# EAGLE design MTCDisplay (EAGLE 7.6.0)

## Sheet 1 of 3
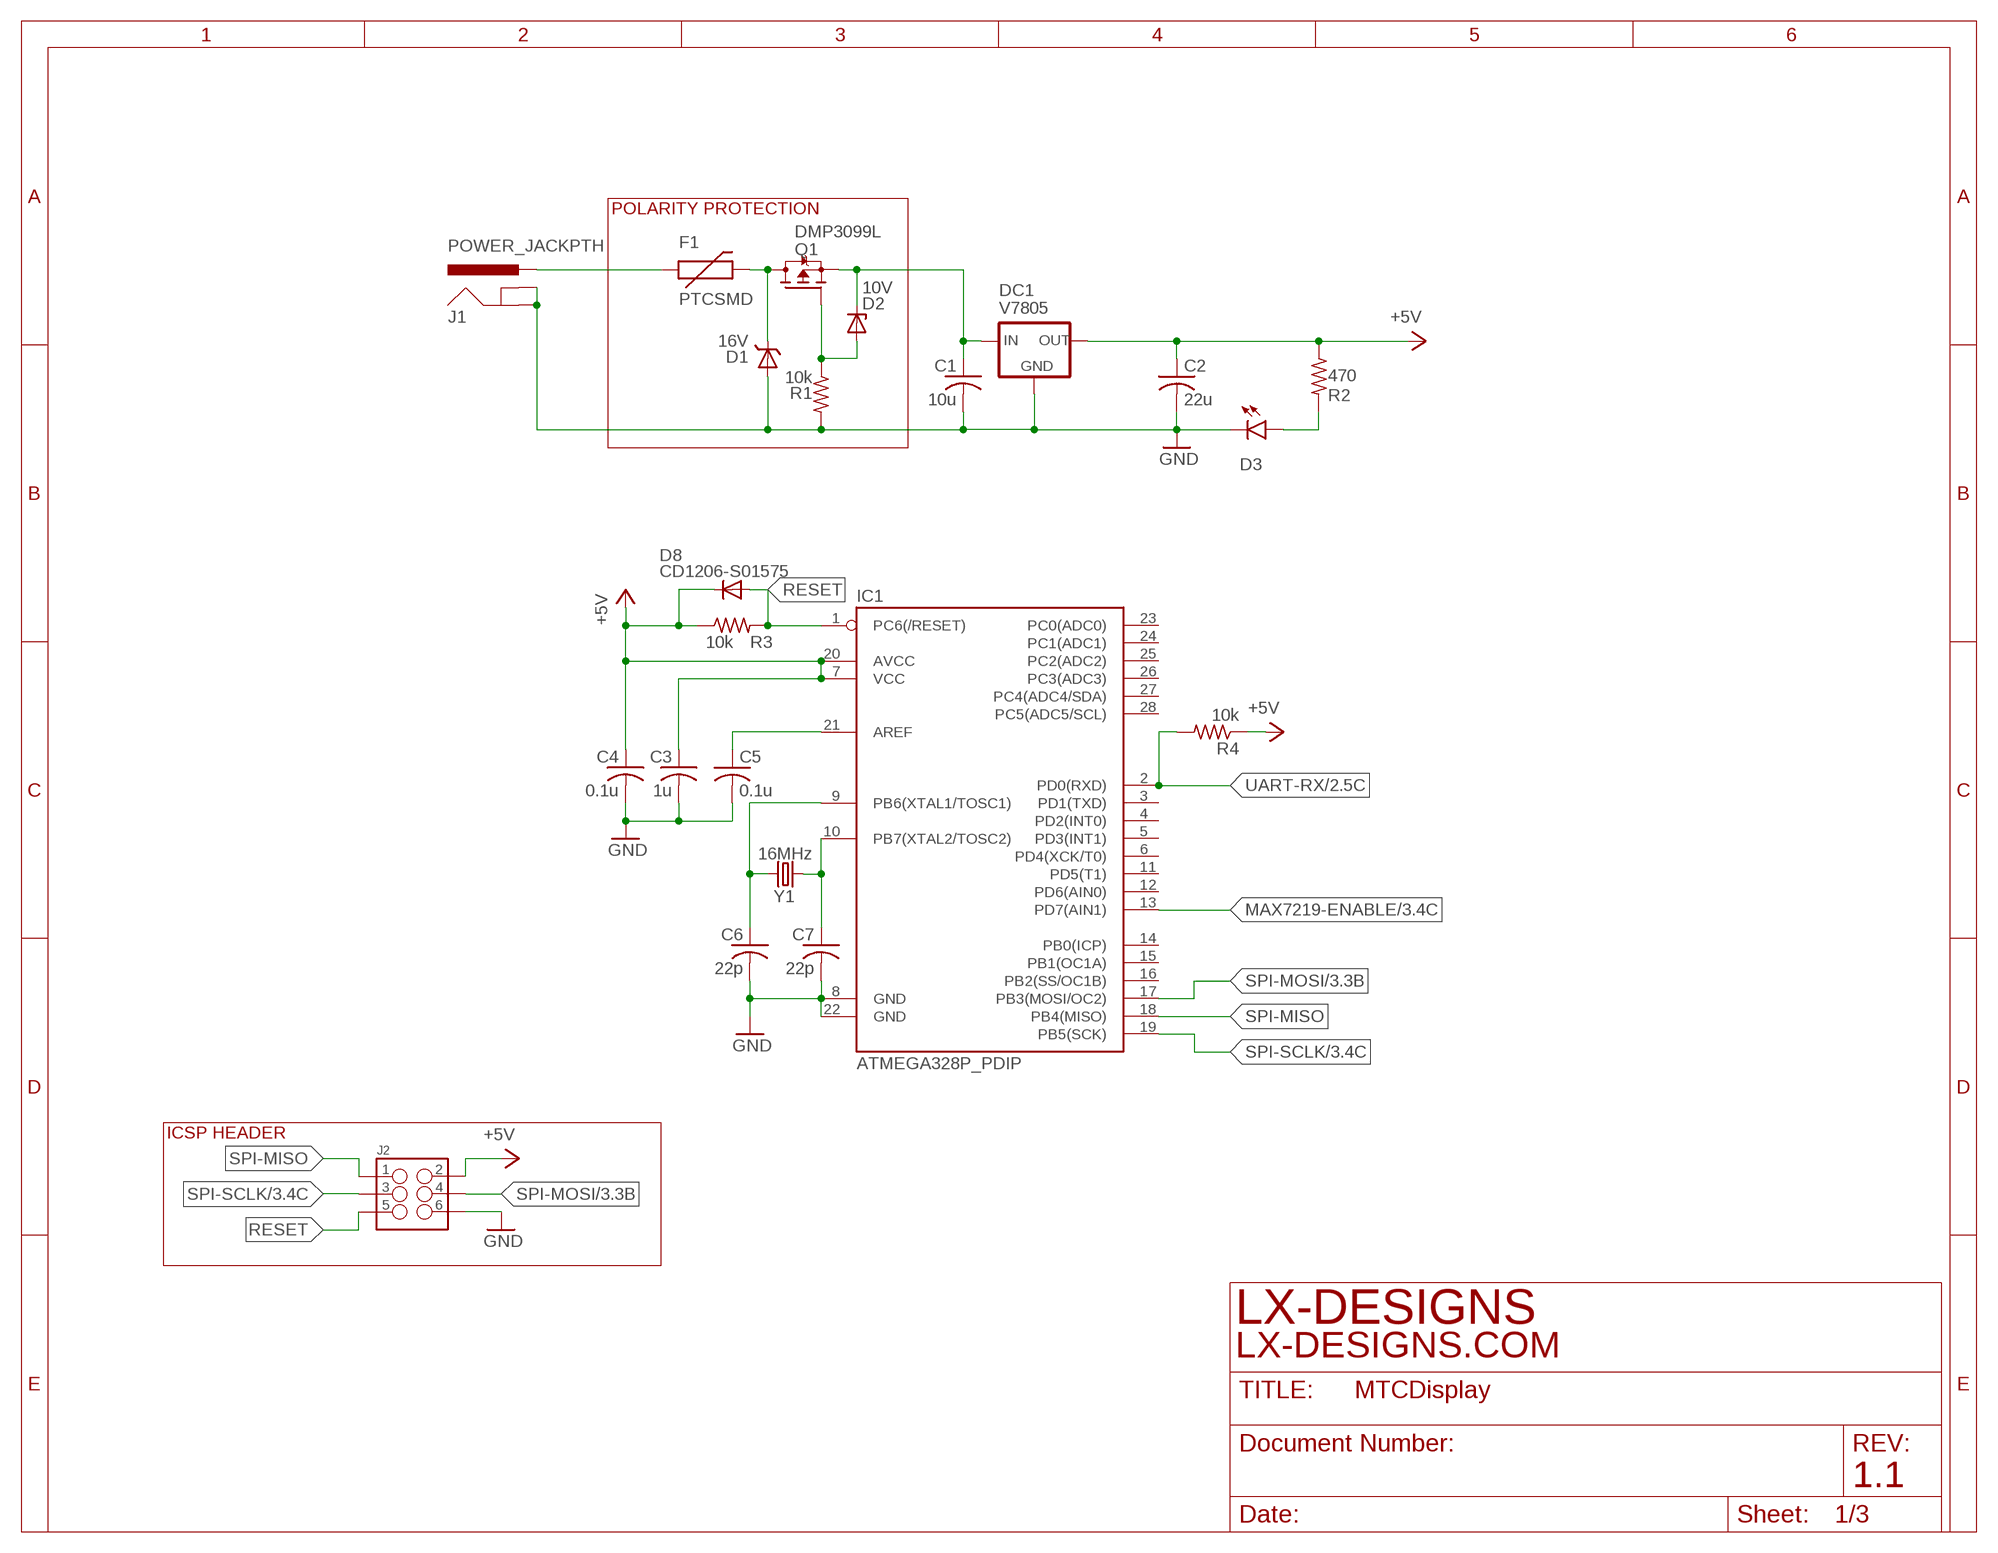
[diagram p0: schematic, sheet 1]

### Parts
C1  10u  C-USC0805K  [C0805K]
C2  22u  C-USC0805K  [C0805K]
C3  1u  C-USC0805K  [C0805K]
C4  0.1u  C-USC0805K  [C0805K]
C5  0.1u  C-USC0805K  [C0805K]
C6  22p  C-USC0805K  [C0805K]
C7  22p  C-USC0805K  [C0805K]
D1  16V  TVS-DIODESOD323-NOSILK  [SOD323-NOSILK]
D2  10V  ZENER-DIODESOD-323  [SOD323]
D3  LED0603  [LED-0603]
D8  CD1206-S01575  DIODE-MINIMELF  [MINIMELF]
DC1  V7805  [V7805]
F1  PTCSMD  [PTC-1206]
IC1  ATMEGA328P_PDIP  [DIL28-3]
J1  POWER_JACKPTH  [POWER_JACK_PTH]
J2  M03X2NO_SILK  [2X3-NS]
Q1  DMP3099L  BSA223SPSOT23  [SOT23]
R1  10k  R-US_R0805  [R0805]
R2  470  R-US_R0805  [R0805]
R3  10k  R-US_R0805  [R0805]
R4  10k  R-US_R0805  [R0805]
Y1  16MHz  CRYSTALHC49US  [HC49US]

### Nets
5V: C1.1 D2.C DC1.IN Q1.2(S)
+5V: C2.1 C3.1 C4.1 D8.C DC1.OUT IC1.7(VCC) IC1.20(AVCC) J2.2 R2.1 R3.1 R4.1 ; also sheet 2,3
GND: C1.2 C2.2 C3.2 C4.2 C5.2 C6.2 C7.2 D1.A D3.C DC1.GND IC1.8(GND) IC1.22(GND) J1.GND J1.GNDBREAK J2.6 R1.2 ; also sheet 2,3
MAX7219-ENABLE: IC1.13(PD7(AIN1)) ; also sheet 3
N$5: C6.1 IC1.9(PB6(XTAL1/TOSC1)) Y1.2
N$12: C5.1 IC1.21(AREF)
N$13: D3.A R2.2
N$15: C7.1 IC1.10(PB7(XTAL2/TOSC2)) Y1.1
N$16: F1.1 J1.PWR
N$17: D1.C F1.2 Q1.3(D)
N$19: D2.A Q1.1(G) R1.1
RESET: D8.A IC1.1(PC6(/RESET)) J2.5 R3.2
SPI-MISO: IC1.18(PB4(MISO)) J2.1
SPI-MOSI: IC1.17(PB3(MOSI/OC2)) J2.4 ; also sheet 3
SPI-SCLK: IC1.19(PB5(SCK)) J2.3 ; also sheet 3
UART-RX: IC1.2(PD0(RXD)) R4.2 ; also sheet 2
Unconnected: IC1.3(PD1(TXD)) IC1.4(PD2(INT0)) IC1.5(PD3(INT1)) IC1.6(PD4(XCK/T0)) IC1.11(PD5(T1)) IC1.12(PD6(AIN0)) IC1.14(PB0(ICP)) IC1.15(PB1(OC1A)) IC1.16(PB2(SS/OC1B)) IC1.23(PC0(ADC0)) IC1.24(PC1(ADC1)) IC1.25(PC2(ADC2)) IC1.26(PC3(ADC3)) IC1.27(PC4(ADC4/SDA)) IC1.28(PC5(ADC5/SCL))

### Notes on the sheet
- POLARITY PROTECTION
- ICSP HEADER
- LX-DESIGNS
- LX-DESIGNS.COM
- 1.1

## Sheet 2 of 3
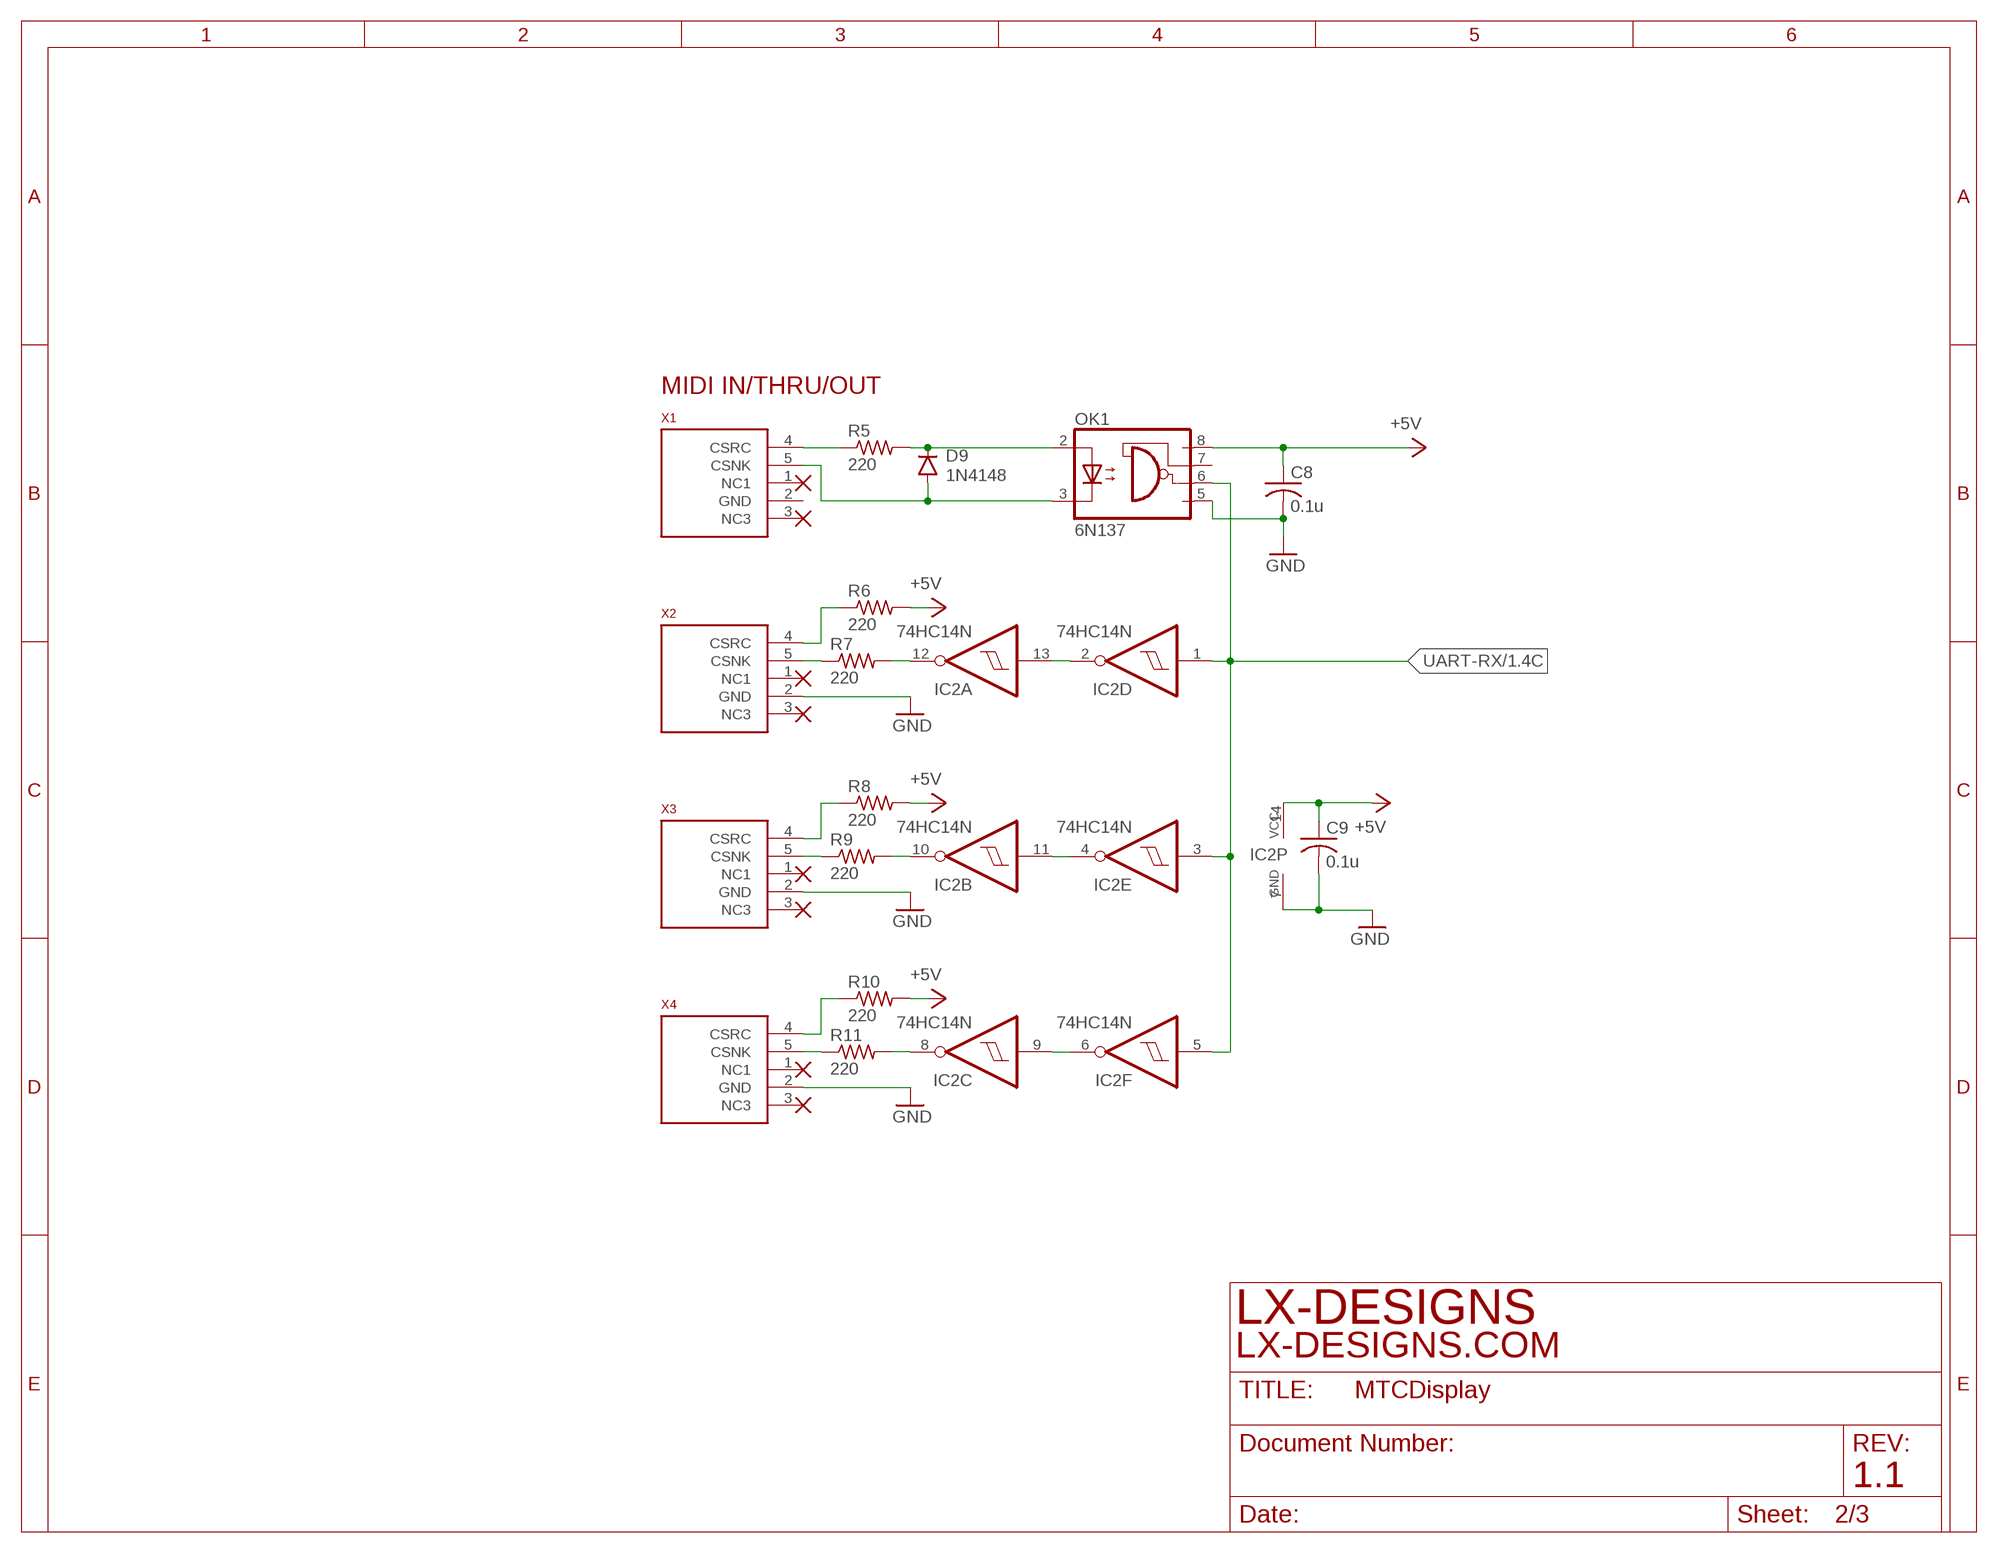
[diagram p1: schematic, sheet 2]

### Parts
C8  0.1u  C-USC0805K  [C0805K]
C9  0.1u  C-USC0805K  [C0805K]
D9  1N4148  DIODE1N4148  [DIODE-1N4148]
IC2  74HC14N  [DIL14]
OK1  6N137  [DIL08]
R5  220  R-US_R0805  [R0805]
R6  220  R-US_R0805  [R0805]
R7  220  R-US_R0805  [R0805]
R8  220  R-US_R0805  [R0805]
R9  220  R-US_R0805  [R0805]
R10  220  R-US_R0805  [R0805]
R11  220  R-US_R0805  [R0805]
X1  57PC5FSWITCHCRAFT  [DIN_5_FEMALE_SUPPORT]
X2  57PC5FSWITCHCRAFT  [DIN_5_FEMALE_SUPPORT]
X3  57PC5FSWITCHCRAFT  [DIN_5_FEMALE_SUPPORT]
X4  57PC5FSWITCHCRAFT  [DIN_5_FEMALE_SUPPORT]

### Nets
+5V: C8.1 C9.1 IC2.14(P:VCC) OK1.8(VCC) R6.2 R8.2 R10.2 ; also sheet 1,3
GND: C8.2 C9.2 IC2.7(P:GND) OK1.5(GND) X2.2(GND) X3.2(GND) X4.2(GND) ; also sheet 1,3
N$1: R5.1 X1.4(CSRC)
N$2: D9.C OK1.2(A) R5.2
N$3: D9.A OK1.3(C) X1.5(CSNK)
N$6: IC2.2(D:O) IC2.13(A:I)
N$7: IC2.12(A:O) R7.2
N$9: IC2.10(B:O) R9.2
N$10: R7.1 X2.5(CSNK)
N$11: R6.1 X2.4(CSRC)
N$18: IC2.8(C:O) R11.2
N$26: R9.1 X3.5(CSNK)
N$27: R8.1 X3.4(CSRC)
N$28: IC2.4(E:O) IC2.11(B:I)
N$29: IC2.6(F:O) IC2.9(C:I)
N$31: R11.1 X4.5(CSNK)
N$32: R10.1 X4.4(CSRC)
UART-RX: IC2.1(D:I) IC2.3(E:I) IC2.5(F:I) OK1.6(VO) ; also sheet 1
Unconnected: OK1.7(VE) X1.1(NC1) X1.2(GND) X1.3(NC3) X2.1(NC1) X2.3(NC3) X3.1(NC1) X3.3(NC3) X4.1(NC1) X4.3(NC3)

### Notes on the sheet
- MIDI IN/THRU/OUT
- LX-DESIGNS
- LX-DESIGNS.COM
- 1.1

## Sheet 3 of 3
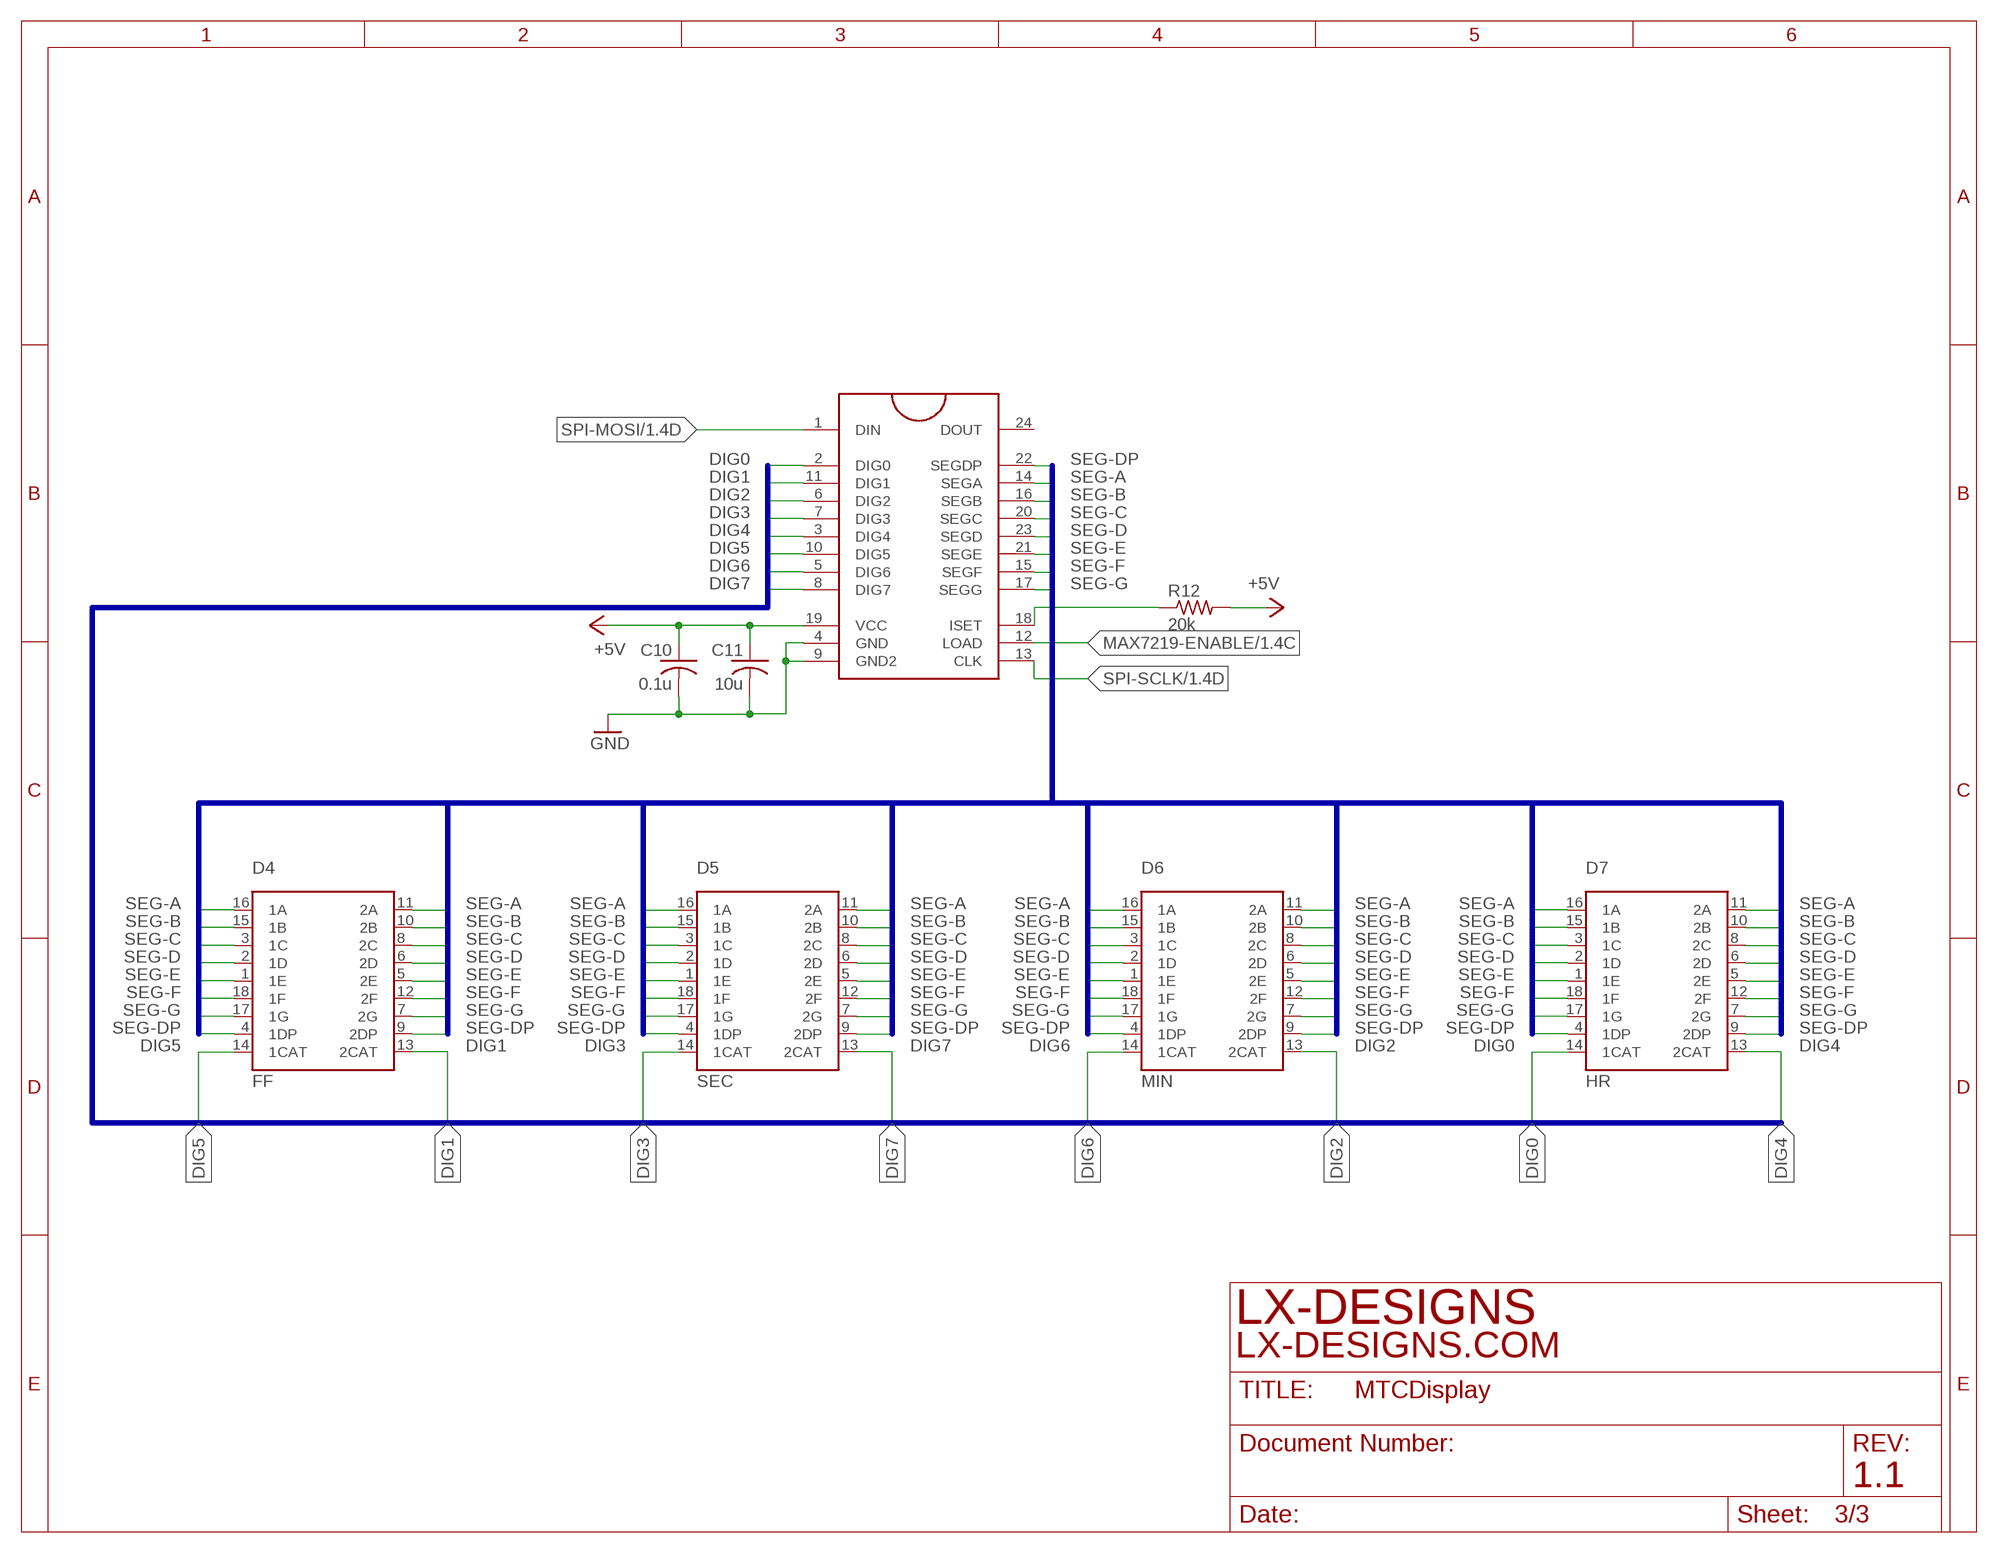
[diagram p2: schematic, sheet 3]

### Parts
C10  0.1u  C-USC0805K  [C0805K]
C11  10u  C-USC0805K  [C0805K]
D4  FF  299-XX-618-10-002000  [299-XX-43-618-10-002000]
D5  SEC  299-XX-618-10-002000  [299-XX-43-618-10-002000]
D6  MIN  299-XX-618-10-002000  [299-XX-43-618-10-002000]
D7  HR  299-XX-618-10-002000  [299-XX-43-618-10-002000]
IC3  MAX7219DIP  [DIL24]
R12  20k  R-US_R0805  [R0805]

### Nets
+5V: C10.1 C11.1 IC3.19(VCC) R12.2 ; also sheet 1,2
DIG0: D7.14(1CAT) IC3.2(DIG0)
DIG1: D4.13(2CAT) IC3.11(DIG1)
DIG2: D6.13(2CAT) IC3.6(DIG2)
DIG3: D5.14(1CAT) IC3.7(DIG3)
DIG4: D7.13(2CAT) IC3.3(DIG4)
DIG5: D4.14(1CAT) IC3.10(DIG5)
DIG6: D6.14(1CAT) IC3.5(DIG6)
DIG7: D5.13(2CAT) IC3.8(DIG7)
GND: C10.2 C11.2 IC3.4(GND) IC3.9(GND2) ; also sheet 1,2
MAX7219-ENABLE: IC3.12(LOAD) ; also sheet 1
N$4: IC3.18(ISET) R12.1
SEG-A: D4.11(2A) D4.16(1A) D5.11(2A) D5.16(1A) D6.11(2A) D6.16(1A) D7.11(2A) D7.16(1A) IC3.14(SEGA)
SEG-B: D4.10(2B) D4.15(1B) D5.10(2B) D5.15(1B) D6.10(2B) D6.15(1B) D7.10(2B) D7.15(1B) IC3.16(SEGB)
SEG-C: D4.3(1C) D4.8(2C) D5.3(1C) D5.8(2C) D6.3(1C) D6.8(2C) D7.3(1C) D7.8(2C) IC3.20(SEGC)
SEG-D: D4.2(1D) D4.6(2D) D5.2(1D) D5.6(2D) D6.2(1D) D6.6(2D) D7.2(1D) D7.6(2D) IC3.23(SEGD)
SEG-DP: D4.4(1DP) D4.9(2DP) D5.4(1DP) D5.9(2DP) D6.4(1DP) D6.9(2DP) D7.4(1DP) D7.9(2DP) IC3.22(SEGDP)
SEG-E: D4.1(1E) D4.5(2E) D5.1(1E) D5.5(2E) D6.1(1E) D6.5(2E) D7.1(1E) D7.5(2E) IC3.21(SEGE)
SEG-F: D4.12(2F) D4.18(1F) D5.12(2F) D5.18(1F) D6.12(2F) D6.18(1F) D7.12(2F) D7.18(1F) IC3.15(SEGF)
SEG-G: D4.7(2G) D4.17(1G) D5.7(2G) D5.17(1G) D6.7(2G) D6.17(1G) D7.7(2G) D7.17(1G) IC3.17(SEGG)
SPI-MOSI: IC3.1(DIN) ; also sheet 1
SPI-SCLK: IC3.13(CLK) ; also sheet 1
Unconnected: IC3.24(DOUT)

### Buses
SEG-A,SEG-B,SEG-C,SEG-D,SEG-E,SEG-F,SEG-G,SEG-DP
DIG0,DIG1,DIG2,DIG3,DIG4,DIG5,DIG6,DIG7

### Notes on the sheet
- LX-DESIGNS
- LX-DESIGNS.COM
- 1.1

## Library data of the parts
C1-C11 = rcl:C-US: CAPACITOR, American symbol
D1 = diode:TVS-DIODE
D2 = diode:ZENER-DIODE: Z-Diode
D3 = SparkFun-LED:LED: LEDs Standard schematic elements and footprints for 5mm, 3mm, 1206, and 0603 sized LEDs. 5mm - Spark Fun Electronics SKU : COM-00529 (and others)
D4-D7 = con-millmax:299-XX-618-10-002000: HDSP-5523 in Mill-Max 299-xx-618-10-002000 Socket
D8 = diode:DIODE-: DIODE
D9 = SparkFun-DiscreteSemi:DIODE: Diode These are standard reverse protection diodes and small signal diodes. SMA package can handle up to about 1A. SOD-323 can handle about 200mA. What the SOD-323 package when ordering, there are some mfgs out there that are 5-pin packages.; PROD_ID: DIO-08378
DC1 = v-reg:V7805
F1 = SparkFun-PowerIC:PTC: Resettable Fuse PTC Resettable Fuse. Spark Fun Electronics SKU : COM-08357; PROD_ID: RES-11150
IC1 = SparkFun-DigitalIC:ATMEGA328P_PDIP: uC used in the Arduino 32kb flash, 1k EEPROM, 2k SRAM This is the through-hole version of this chip.
IC2 = 74xx-eu:74*14: Hex schmitt trigger INVERTER
IC3 = SparkFun-DigitalIC:MAX7219: 8-digit, 8-segment LED display driver, serial input
J1 = SparkFun-Connectors:POWER_JACK: Power Jack This is the standard 5.5mm barrel jack for power. The PTH is the most common, proven, reliable, footprint. The Slot footprint only works if the mill layer is transmitted to the PCB fab house so be warned. Mating wall wart : TOL-00298 (and others); PROD_ID: CONN-08197
J2 = SparkFun-Connectors:M03X2: 2x3 .1" header. Shrouded, with keying- CONN-10681 SMT- CONN-11415 Pogo pins- HW-11044
OK1 = optocoupler:6N137: MOTOROLA OPTO COUPLER; MPN: 6N137; OC_FARNELL: 1328376; OC_NEWARK: 52M1895
Q1 = transistor-fet:BSA223SP: OptiMOS(R)-P Small-Signal-Transistor P-Channel, Enhancement mode, Super Logic Level (2.5 V rated) Source: http://www.infineon.com/upload/Document/BSA223SP_Rev1.3.pdf
R1-R12 = rcl:R-US_: RESISTOR, American symbol
X1-X4 = con-switchcraft:57PC5F
Y1 = SparkFun-FreqCtrl:CRYSTAL: Various standard crystals. Proven footprints.

## Net classes
3 usbvcc: width 0.508 mm, drill 0.61 mm, clearance 0.254 mm

## Board
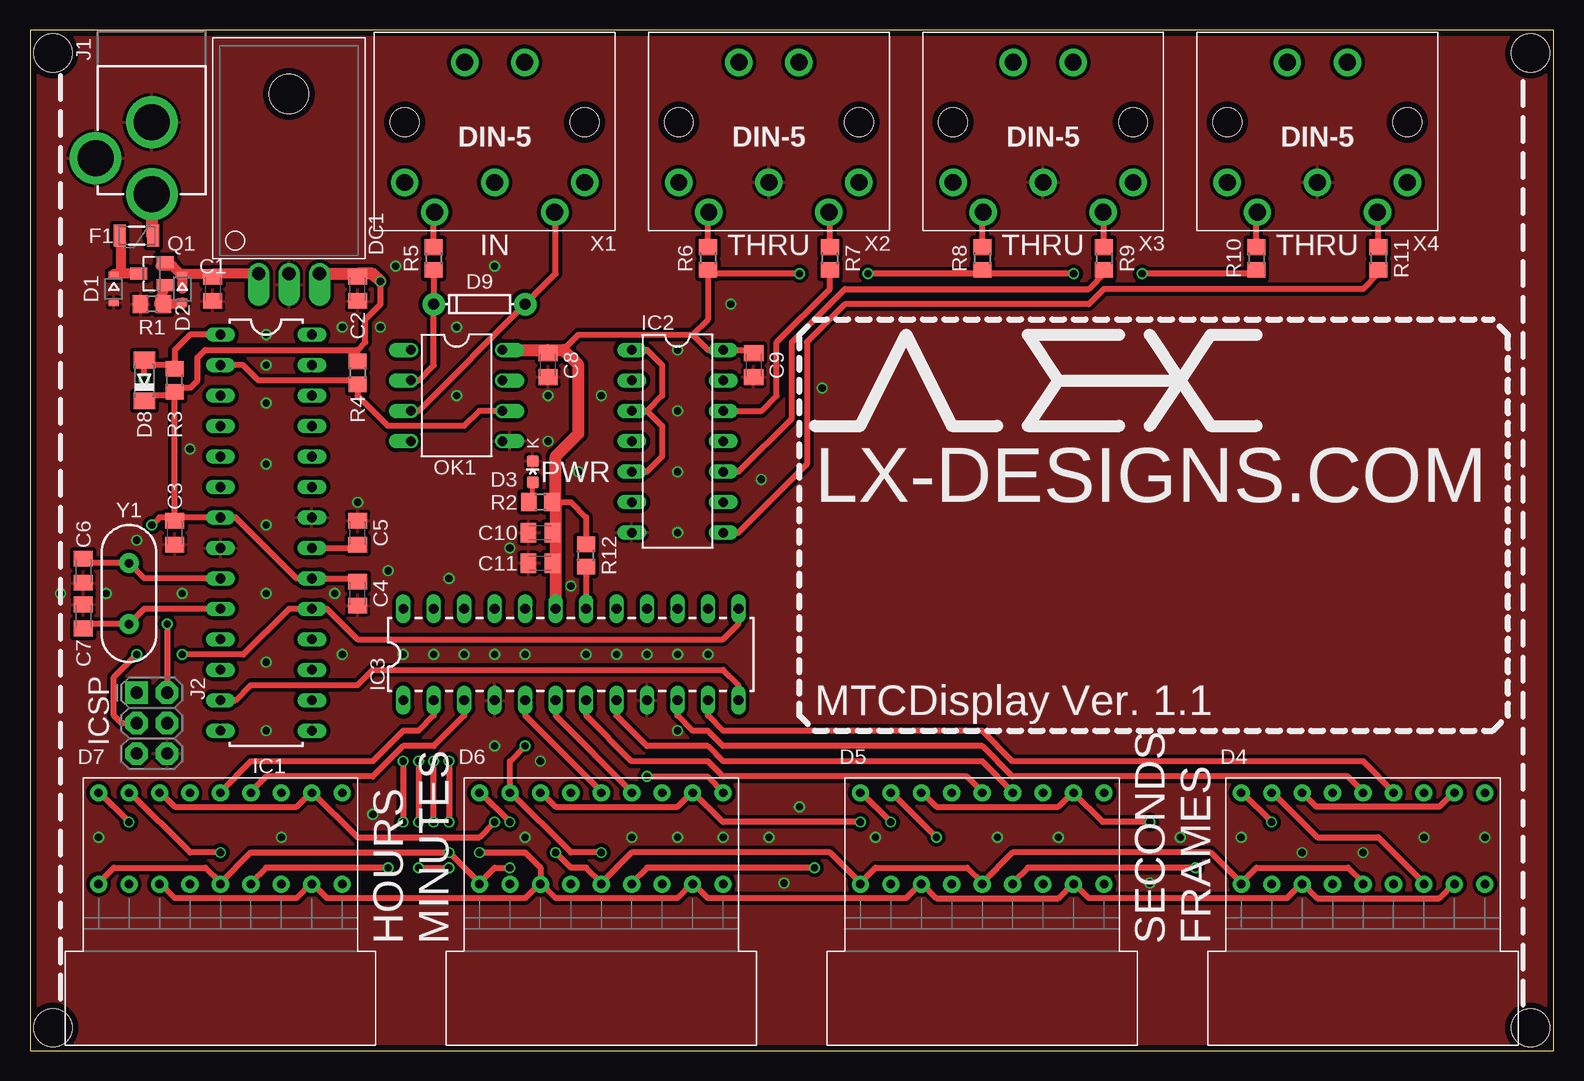
[diagram p3: board, top side]
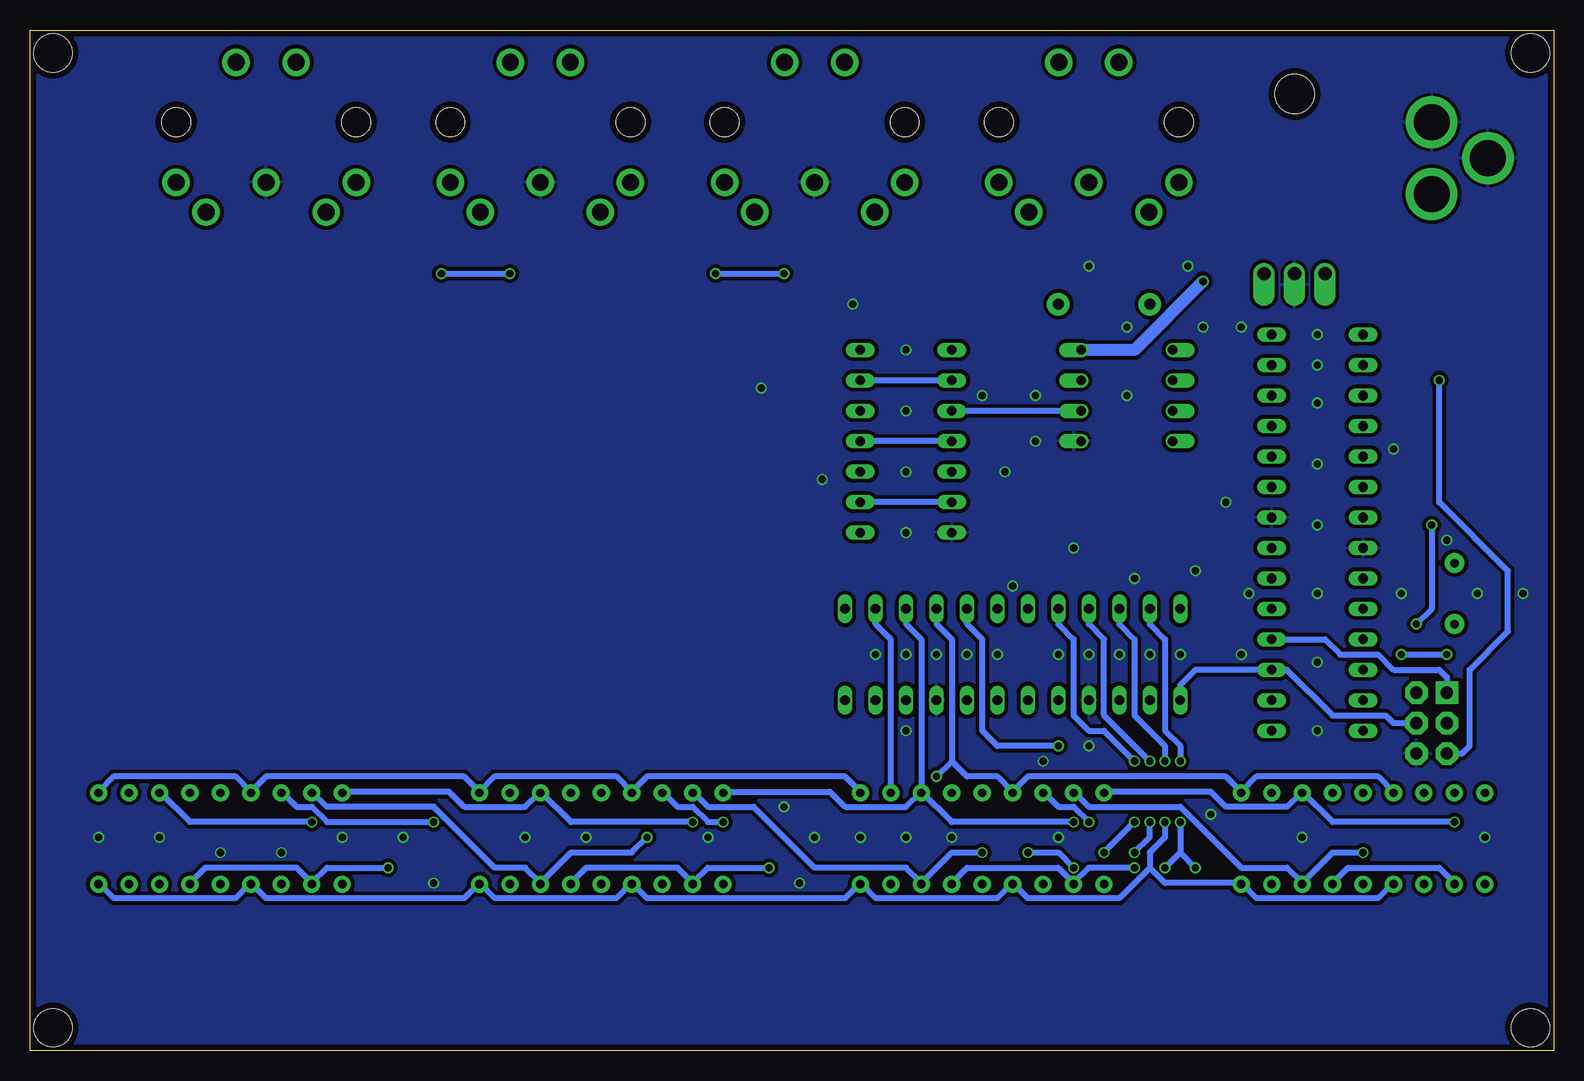
[diagram p4: board, bottom side, seen from below]

Size 127 x 85.09 mm. Coordinates in mm from the lower left corner, seen from the top.
Outline: 0,0 127,0 127,85.09 0,85.09 0,0
Copper layers (1*16): Top 0.035mm / dielectric 1.6mm / Bottom 0.035mm
Design rules "Elecrow_2-layer_PCB_eagle_rule": minimum track width 6mil, minimum drill 12mil, track to track 6mil, track to pad 6mil, pad to pad 6mil, via to via 8mil, smd to smd 0mil, copper to edge 20mil, drill to drill 10mil, minimum pad ring 6mil, minimum via ring 6mil, stop-mask expansion 0mil, vias tented up to drill 100mil, thermal gap 10mil
Holes 3.3 mm at 21.59,79.76
Holes 3.17 mm at 125.09,83.19 1.91,83.19 1.91,1.91 125.09,1.91

### Footprints (pad centres in the part's own frame; a part is rotated, then mirrored left to right if it is on the bottom)
C0805K = smd 1.3 x 1.6: 1 -1,0; 2 1,0
SOD323-NOSILK = smd 0.63 x 0.83: A 1.125,0; C -1.125,0
SOD323 = smd 0.63 x 0.83: A 1.115,0; C -1.115,0
LED-0603 = smd 1 x 1: A 0,-0.877; C 0,0.877
299-XX-43-618-10-002000 = drill 0.7 pad 1.422: 1 -10.16,-1.372; 2 -7.62,-1.372; 3 -5.08,-1.372; 4 -2.54,-1.372; 5 0,-1.372; 6 2.54,-1.372; 7 5.08,-1.372; 8 7.62,-1.372; 9 10.16,-1.372; 10 10.16,6.248; 11 7.62,6.248; 12 5.08,6.248; 13 2.54,6.248; 14 0,6.248; 15 -2.54,6.248; 16 -5.08,6.248; 17 -7.62,6.248; 18 -10.16,6.248
MINIMELF = smd 1.4 x 1.8: A 1.7,0; C -1.7,0
DIODE-1N4148 = drill 0.9 pad 1.88: A -3.81,0; C 3.81,0
V7805 = drill 1.1 pad 1.778 offset: GND 0,0; IN -2.54,0; OUT 2.54,0
PTC-1206 = smd 1 x 1.8: 1 -1.4,0; 2 1.4,0
DIL28-3 = drill 0.813 long: 1 -16.51,-3.81; 2 -13.97,-3.81; 3 -11.43,-3.81; 4 -8.89,-3.81; 5 -6.35,-3.81; 6 -3.81,-3.81; 7 -1.27,-3.81; 8 1.27,-3.81; 9 3.81,-3.81; 10 6.35,-3.81; 11 8.89,-3.81; 12 11.43,-3.81; 13 13.97,-3.81; 14 16.51,-3.81; 15 16.51,3.81; 16 13.97,3.81; 17 11.43,3.81; 18 8.89,3.81; 19 6.35,3.81; 20 3.81,3.81; 21 1.27,3.81; 22 -1.27,3.81; 23 -3.81,3.81; 24 -6.35,3.81; 25 -8.89,3.81; 26 -11.43,3.81; 27 -13.97,3.81; 28 -16.51,3.81
DIL14 = drill 0.813 long: 1 -7.62,-3.81; 2 -5.08,-3.81; 3 -2.54,-3.81; 4 0,-3.81; 5 2.54,-3.81; 6 5.08,-3.81; 7 7.62,-3.81; 8 7.62,3.81; 9 5.08,3.81; 10 2.54,3.81; 11 0,3.81; 12 -2.54,3.81; 13 -5.08,3.81; 14 -7.62,3.81
DIL24 = drill 0.813 long: 1 -13.97,-3.81; 2 -11.43,-3.81; 3 -8.89,-3.81; 4 -6.35,-3.81; 5 -3.81,-3.81; 6 -1.27,-3.81; 7 1.27,-3.81; 8 3.81,-3.81; 9 6.35,-3.81; 10 8.89,-3.81; 11 11.43,-3.81; 12 13.97,-3.81; 13 13.97,3.81; 14 11.43,3.81; 15 8.89,3.81; 16 6.35,3.81; 17 3.81,3.81; 18 1.27,3.81; 19 -1.27,3.81; 20 -3.81,3.81; 21 -6.35,3.81; 22 -8.89,3.81; 23 -11.43,3.81; 24 -13.97,3.81
POWER_JACK_PTH = drill 2.997 pad 4.318: GND 0,7.7; GNDBREAK 4.7,10.7; PWR 0,13.7
2X3-NS = drill 1.016 pad 1.88 square: 1 -2.54,-1.27 | drill 1.016 pad 1.88 octagon: 2 -2.54,1.27; 3 0,-1.27; 4 0,1.27; 5 2.54,-1.27; 6 2.54,1.27
DIL08 = drill 0.813 offset: 1 -3.81,-3.81; 2 -1.27,-3.81; 3 1.27,-3.81; 4 3.81,-3.81; 5 3.81,3.81; 6 1.27,3.81; 7 -1.27,3.81; 8 -3.81,3.81
SOT23 = smd 1 x 1.4: 1 -0.95,-1.1; 2 0.95,-1.1; 3 0,1.1
R0805 = smd 1.3 x 1.5: 1 -0.95,0; 2 0.95,0
DIN_5_FEMALE_SUPPORT = drill 1.4 pad 2.286: 1 7.506,0; 2 0,0; 3 -7.506,0; 4 5.004,2.489; 5 -5.004,2.489; P$3 -2.502,-10.008; P$4 2.502,-10.008 | hole 2.388: -7.506,-5.004; 7.506,-5.004
HC49US = drill 0.7 pad 1.651: 1 -2.54,0; 2 2.54,0

### Placement (x,y rotation side)
C1  15.24,63.5 270 top
C2  27.3,63.5 270 top
C3  12.06,43.18 270 top
C4  27.3,38.1 270 top
C5  27.3,43.18 90 top
C6  4.45,40.01 270 top
C7  4.45,36.2 90 top
C8  43.18,57.15 270 top
C9  60.33,57.15 270 top
C10  42.55,43.18 180 top
C11  42.55,40.64 180 top
D1  6.99,63.5 270 top
D2  12.7,63.5 270 top
D3  41.91,48.26 0 top
D4  111.12,15.24 0 top
D5  79.38,15.24 0 top
D6  47.62,15.24 0 top
D7  15.88,15.24 0 top
D8  9.53,55.88 90 top
D9  37.47,62.23 180 top
DC1  21.59,64.77 0 top
F1  8.89,67.94 180 top
IC1  19.68,43.18 270 top
IC2  53.98,50.8 270 top
IC3  45.09,33.02 0 top
J1  10.16,85.09 180 top
J2  10.16,27.3 270 top
OK1  35.56,54.61 270 top
Q1  10.16,64.77 90 top
R1  10.16,62.23 180 top
R2  42.55,45.72 180 top
R3  12.06,55.88 90 top
R4  27.3,56.52 270 top
R5  33.66,66.04 270 top
R6  56.52,66.04 270 top
R7  66.67,66.04 270 top
R8  79.38,66.04 270 top
R9  89.53,66.04 270 top
R10  102.23,66.04 270 top
R11  112.39,66.04 270 top
R12  46.35,41.27 90 top
X1  38.73,72.39 180 top
X2  61.59,72.39 180 top
X3  84.45,72.39 180 top
X4  107.31,72.39 180 top
Y1  8.26,38.1 90 top

### Tracks (layer width: path | path; a pad name or v marks a point on that pad's centre or on a via)
5V
  Top 0.508: Q1.2 10.87,65.41 10.79,65.41
  Top 0.813: 10.87,65.41 11.91,65.41 D2.C | D2.C 12.7,63.5 | D2.C 12.7,64.77 15.24,64.77 | DC1.IN 15.24,64.77 | 15.24,64.77 C1.1
+5V  (via drill 0.6)
  Top 0.406: 43.81,45.72 R2.1
  Top 0.508: C4.1 27.3,39.37 IC1.20 22.23,39.37 17.14,44.45 IC1.7 12.06,44.45 | 12.06,44.45 12.06,54.61 | R10.2 102.23,64.77 v92.71,64.77 | v87,64.77 79.38,64.77 | 79.38,64.77 R8.2 | 79.38,64.77 v69.85,64.77 | v64.14,64.77 56.84,64.77 | 56.84,64.77 R6.2 | 56.84,64.77 56.52,64.77 56.52,60.96 55.24,59.69 | C9.1 60.33,58.42 IC2.14 56.52,58.42 55.24,59.69 | 44.45,58.42 45.72,59.69 55.24,59.69 | 43.81,45.72 45.09,45.72 46.35,44.45 R12.2 | C3.1 12.06,44.45 | 12.06,44.45 10.79,44.45 v10.16,43.81 | v11.43,35.56 J2.2 | 12.06,54.61 R3.1 12.06,55.24 13.34,55.24 13.97,55.88 13.97,57.78 14.61,58.42 27.3,58.42 | 12.06,54.61 9.96,54.61 D8.C | R4.1 27.3,58.42 | 27.3,58.42 27.94,59.05 27.94,60.96 29.21,62.23 v29.21,64.14
  Top 1.016: OK1.8 43.18,58.42 | C8.1 43.18,58.42 | 43.18,58.42 44.45,58.42 45.72,57.15 45.72,51.44 43.81,49.53 43.81,45.72 43.81,43.18 | 27.3,64.77 28.57,64.77 v29.21,64.14 | 27.3,64.77 C2.1 | C10.1 43.81,43.18 | 43.81,43.18 43.81,40.64 | C11.1 43.81,40.64 | 43.81,40.64 IC3.19 | DC1.OUT 27.3,64.77
  Bottom 0.508: v92.71,64.77 v87,64.77 | v69.85,64.77 v64.14,64.77 | v10.16,43.81 10.16,36.83 v11.43,35.56
  Bottom 1.016: v29.21,64.14 34.92,58.42 OK1.8
DIG0
  Top 0.508: IC3.2 33.66,27.94 32.38,26.67 31.11,26.67 28.57,24.13 18.41,24.13 15.88,21.59 D7.14
DIG1
  Top 0.508: D4.13 113.67,21.59 111.12,24.13 81.92,24.13 79.38,26.67 57.78,26.67 56.52,27.94 IC3.11
DIG2
  Top 0.508: IC3.6 43.81,27.94 50.16,21.59 D6.13
DIG3
  Top 0.508: D5.14 79.38,21.59 78.11,22.86 57.78,22.86 56.52,24.13 50.16,24.13 46.35,27.94 IC3.7
DIG4
  Top 0.508: IC3.3 36.2,27.94 33.66,25.4 31.11,25.4 28.57,22.86 19.68,22.86 18.41,21.59 D7.13
DIG5
  Top 0.508: D4.14 111.12,21.59 109.86,22.86 81.92,22.86 79.38,25.4 57.78,25.4 56.52,26.67 55.24,26.67 53.98,27.94 IC3.10
DIG6
  Top 0.508: IC3.5 41.27,27.94 47.62,21.59 D6.14
DIG7
  Top 0.508: D5.13 81.92,21.59 79.38,24.13 57.78,24.13 56.52,25.4 51.44,25.4 48.9,27.94 IC3.8
GND  (via drill 0.6)
  other vias: 85.72,17.78 70.48,17.78 53.98,17.78 62.87,13.97 41.27,17.78 20.95,17.78 27.3,45.72 19.68,59.69 19.68,53.98 53.98,48.26 53.98,53.34 53.98,43.18 100.97,17.78 93.34,13.97 5.71,17.78 19.68,48.9 19.68,43.81 19.68,32.38 19.68,26.67 41.27,33.02 46.35,33.02 38.73,33.02 33.66,33.02 48.9,33.02 51.44,33.02 53.98,33.02 56.52,33.02 53.98,26.67 13.34,50.16 40.01,41.91 45.09,38.73 29.84,40.01 43.18,50.8 6.35,38.1 28.57,19.68 50.16,17.78 57.78,17.78 61.59,17.78 64.14,20.32 80.64,17.78 95.89,17.78 111.12,16.51 106.05,16.51 116.2,17.78 121.28,17.78 66.04,55.24 60.96,47.62 58.42,62.23 35.56,54.61 35.56,60.33 38.73,65.41 53.98,58.42 42.55,24.13 38.73,25.4 2.54,38.1 25.4,38.1 43.18,54.61 12.7,38.1 30.48,65.41 34.92,39.37 36.2,33.02 31.11,33.02 26.04,33.02 19.68,38.1 8.89,42.55 19.68,57.15 26.04,60.33 29.21,60.33 47.62,54.61 45.72,48.26
  pour Top (isolate 0.305): 0,0 0,85.09 127,85.09 127,0
  pour Bottom (isolate 0.305): 0,0 0,85.09 127,85.09 127,0
MAX7219-ENABLE
  Top 0.508: IC1.13 17.14,29.21 18.41,30.48 27.3,30.48 28.57,31.75 57.78,31.75 59.05,30.48 IC3.12
N$1
  Top 0.508: R5.1 33.66,69.83 X1.4
N$2
  Top 0.508: R5.2 D9.C 33.66,57.15 32.38,55.88 OK1.2
N$3
  Top 0.508: X1.5 43.81,69.83 43.81,64.77 D9.A 32.38,53.34 OK1.3
N$4
  Top 0.508: R12.1 IC3.18
N$5
  Top 0.508: IC1.9 9.53,39.37 Y1.2 4.45,40.64 C6.1
N$6
  Bottom 0.508: IC2.2 IC2.13
N$7
  Top 0.508: IC2.12 60.96,53.34 62.23,54.61 62.23,59.05 66.67,63.5 R7.2
N$9
  Top 0.508: IC2.10 59.05,48.26 63.5,52.7 63.5,59.05 67.94,63.5 88.27,63.5 89.53,64.77 R9.2
N$10
  Top 0.508: R7.1 66.67,69.83 X2.5
N$11
  Top 0.508: R6.1 56.52,69.83 X2.4
N$12
  Top 0.508: IC1.21 26.67,41.91 C5.1
N$13
  Top 0.406: R2.2 41.91,45.72 D3.A
N$15
  Top 0.508: IC1.10 9.53,36.83 Y1.1 4.45,35.56 C7.1
N$16
  Top 1.016: J1.PWR 10.16,67.94 F1.1
N$17
  Top 0.508: D1.C 6.99,64.77
  Top 0.813: Q1.3 7.62,64.77 | 6.99,64.77 7.62,64.77 | 7.62,64.77 7.62,67.31 F1.2
N$18
  Top 0.508: R11.2 112.39,64.77 111.12,63.5 89.53,63.5 88.27,62.23 67.94,62.23 64.77,59.05 64.77,48.9 59.05,43.18 IC2.8
N$19
  Top 0.508: 10.73,62.23 R1.1
  Top 0.813: D2.A 12.7,62.23 R1.1 | 10.73,62.23 Q1.1
N$26
  Top 0.508: R9.1 89.53,69.83 X3.5
N$27
  Top 0.508: R8.1 79.38,69.83 X3.4
N$28
  Bottom 0.508: IC2.4 IC2.11
N$29
  Bottom 0.508: IC2.6 IC2.9
N$31
  Top 0.508: R11.1 112.39,69.83 X4.5
N$32
  Top 0.508: R10.1 102.23,69.83 X4.4
RESET  (via drill 0.6)
  Top 0.508: IC1.1 13.34,59.69 12.06,58.42 12.06,57.15 | R3.2 12.06,57.15 | 12.06,57.15 9.53,57.15 D8.A v9.53,55.88
  Bottom 0.508: J2.5 7.62,24.77 6.99,25.4 6.99,31.75 3.81,34.92 3.81,40.01 9.53,45.72 v9.53,55.88
SEG-A  (via drill 0.6)
  Top 0.508: D7.16 10.79,21.59 12.06,20.32 22.23,20.32 23.5,21.59 | D5.16 74.3,21.59 75.56,20.32 85.72,20.32 87,21.59 D5.11 89.43,19.05 v93.34,19.05 | v69.22,19.05 57.78,19.05 55.24,21.59 | 23.5,21.59 27.3,17.78 37.47,17.78 v38.73,19.05 | 23.5,21.59 D7.11 | D4.11 118.75,21.59 117.47,20.32 107.21,20.32 D4.16 | D6.16 42.65,21.49 43.81,20.32 53.98,20.32 55.24,21.59 | 55.24,21.59 D6.11
  Bottom 0.508: v93.34,19.05 102.23,19.05 103.5,20.32 104.78,20.32 105.94,21.49 D4.16 | D5.16 74.19,21.49 73.03,20.32 71.75,20.32 70.48,19.05 v69.22,19.05 | D6.16 42.44,21.49 41.27,20.32 40.01,20.32 v38.73,19.05 | D6.11 55.24,34.29 56.52,35.56 IC3.14
SEG-B  (via drill 0.6)
  Top 0.508: v51.44,22.86 56.52,22.86 57.78,21.59 D6.10
  Bottom 0.508: D7.15 13.34,21.59 14.61,22.86 24.77,22.86 26.04,21.59 | D7.10 26.04,21.59 | 26.04,21.59 27.3,22.86 43.81,22.86 45.09,21.59 | D6.15 45.09,21.59 | 45.09,21.59 46.35,22.86 48.9,22.86 50.16,24.13 | D6.10 57.78,21.59 59.05,22.86 75.56,22.86 76.83,21.59 | D5.15 76.83,21.59 | 76.83,21.59 78.11,22.86 88.27,22.86 89.53,21.59 | D5.10 89.53,21.59 | 89.53,21.59 90.81,22.86 107.31,22.86 108.58,21.59 | D4.15 108.58,21.59 | 108.58,21.59 109.86,22.86 120.02,22.86 121.28,21.59 D4.10 | IC3.16 51.44,35.56 50.16,34.29 50.16,24.13 | 50.16,24.13 v51.44,22.86
SEG-C  (via drill 0.6)
  Top 0.508: D4.8 118.75,13.97 117.47,12.7 107.31,12.7 106.05,13.97 D4.3 105.94,13.87 104.78,12.7 88.27,12.7 87,13.97 | 74.3,13.97 75.56,12.7 85.72,12.7 87,13.97 | 87,13.97 D5.8 | D5.3 74.3,13.97 | 74.3,13.97 73.03,12.7 56.52,12.7 55.24,13.97 | D6.8 55.24,13.97 | 55.24,13.97 53.98,12.7 43.81,12.7 42.55,13.97 | 42.55,13.97 D6.3 42.55,15.24 41.27,16.51 v37.47,16.51 | 42.55,13.97 41.27,12.7 24.77,12.7 23.5,13.97 | 23.5,13.97 D7.8 | 23.5,13.97 22.23,12.7 12.06,12.7 10.79,13.97 D7.3 | v34.92,24.13 v34.92,19.05
  Bottom 0.508: IC3.20 41.27,35.56 40.01,34.29 40.01,27.94 38.73,26.67 37.47,26.67 v34.92,24.13 | v34.92,19.05 v37.47,16.51
SEG-D  (via drill 0.6)
  Top 0.508: v97.16,15.24 83.19,15.24 81.92,13.97 D5.6 | D7.6 18.41,13.97 19.68,15.24 v29.84,15.24 | v65.41,15.24 51.44,15.24 50.16,13.97 D6.6 | v31.11,24.13 v31.11,19.05 | v32.38,15.24 v34.92,15.24
  Bottom 0.508: 103.5,13.97 104.78,15.24 112.39,15.24 113.67,13.97 D4.6 | 71.75,13.97 73.03,15.24 80.64,15.24 81.92,13.97 D5.6 | D4.2 103.5,13.97 | 103.5,13.97 102.23,15.24 v97.16,15.24 | D5.2 71.75,13.97 | 71.75,13.97 70.48,15.24 v65.41,15.24 | D6.6 50.16,13.97 48.9,15.24 41.27,15.24 40.01,13.97 | D6.2 40.01,13.97 | 40.01,13.97 38.73,15.24 v34.92,15.24 | D7.6 18.41,13.97 17.14,15.24 9.53,15.24 8.26,13.97 D7.2 | IC3.23 33.66,35.56 32.38,34.29 32.38,26.67 31.11,25.4 v31.11,24.13 | v31.11,19.05 31.11,16.51 | v32.38,15.24 31.11,16.51 | 31.11,16.51 v29.84,15.24
SEG-DP  (via drill 0.6)
  Top 0.508: v32.38,24.13 v32.38,19.05
  Bottom 0.508: 108.58,13.97 109.86,12.7 120.02,12.7 121.28,13.97 D4.9 | D7.4 13.34,13.97 14.61,12.7 24.77,12.7 26.04,13.97 | D7.9 26.04,13.97 | 45.09,13.97 43.81,12.7 36.2,12.7 33.66,15.24 | D6.4 45.09,13.97 | 45.09,13.97 46.35,12.7 56.52,12.7 57.78,13.97 | D6.9 57.78,13.97 | 57.78,13.97 59.05,12.7 75.56,12.7 76.83,13.97 | D5.4 76.83,13.97 | 76.83,13.97 78.11,12.7 88.27,12.7 89.53,13.97 | IC3.22 36.2,35.56 34.92,34.29 34.92,27.94 32.38,25.4 v32.38,24.13 | v32.38,19.05 32.38,17.78 33.66,16.51 33.66,15.24 | 26.04,13.97 32.38,13.97 33.66,15.24 | D5.9 89.53,13.97 | 89.53,13.97 90.81,12.7 107.31,12.7 108.58,13.97 | 108.58,13.97 D4.4
SEG-E  (via drill 0.6)
  Top 0.508: D7.1 5.71,13.97 6.99,15.24 14.61,15.24 15.88,13.97 | 69.22,13.97 70.48,15.24 78.11,15.24 79.38,13.97 | 100.97,13.97 102.23,15.24 109.86,15.24 111.12,13.97 D4.5 | D4.1 100.97,13.97 | 100.97,13.97 98.42,16.51 81.92,16.51 79.38,13.97 | 79.38,13.97 D5.5 | D5.1 69.22,13.97 | 69.22,13.97 66.67,16.51 50.16,16.51 47.62,13.97 | D6.5 47.62,13.97 | 47.62,13.97 46.35,15.24 45.09,15.24 v43.81,16.51 | 37.47,13.97 38.73,15.24 v40.01,15.24 | D6.1 37.47,13.97 | 37.47,13.97 v34.92,16.51 18.41,16.51 15.88,13.97 | 15.88,13.97 D7.5 | v33.66,19.05 v33.66,24.13
  Bottom 0.508: v34.92,16.51 33.66,17.78 v33.66,19.05 | v33.66,24.13 37.47,27.94 37.47,34.29 38.73,35.56 IC3.21 | v43.81,16.51 41.27,16.51 v40.01,15.24
SEG-F  (via drill 0.6)
  Top 0.508: D4.18 101.07,21.49 v103.5,19.05 | v71.75,19.05 69.22,21.59 D5.18 | D7.18 5.71,21.59 v8.26,19.05 | D6.18 37.47,21.59 v40.01,19.05
  Bottom 0.508: v71.75,19.05 81.92,19.05 84.45,21.59 | 84.45,21.59 85.72,20.32 90.81,20.32 92.08,21.59 100.86,21.59 D4.18 | 84.45,21.59 D5.12 | v103.5,19.05 113.67,19.05 116.2,21.59 D4.12 | D5.18 69.22,21.59 60.33,21.59 59.05,20.32 53.98,20.32 52.7,21.59 | v8.26,19.05 18.41,19.05 20.95,21.59 | D7.12 20.95,21.59 | 20.95,21.59 22.23,20.32 27.3,20.32 28.57,21.59 37.47,21.59 D6.18 | v40.01,19.05 50.16,19.05 52.7,21.59 | IC3.15 53.98,35.56 52.7,34.29 52.7,21.59 | 52.7,21.59 D6.12
SEG-G  (via drill 0.6)
  Top 0.508: v75.56,17.78 71.75,21.59 D5.17 | D4.17 103.61,21.49 107.31,17.78 112.39,17.78 116.2,13.97 D4.7 | v47.62,16.51 45.09,16.51 40.01,21.59 | 40.01,21.59 D6.17 | v15.88,16.51 13.34,16.51 8.26,21.59 D7.17 | 40.01,21.59 40.01,24.13 v41.27,25.4
  Bottom 0.508: v75.56,17.78 76.83,16.51 81.92,16.51 84.45,13.97 | 84.45,13.97 85.72,15.24 88.27,15.24 93.34,20.32 102.23,20.32 103.5,21.59 D4.17 | D5.17 71.65,21.49 70.48,20.32 66.67,20.32 61.59,15.24 53.98,15.24 52.7,13.97 | 52.7,13.97 50.16,16.51 v47.62,16.51 | D6.7 52.7,13.97 | D6.17 39.9,21.49 38.73,20.32 31.11,20.32 26.04,15.24 22.23,15.24 20.95,13.97 | v15.88,16.51 18.41,16.51 20.95,13.97 | v41.27,25.4 46.35,25.4 47.62,26.67 47.62,34.29 48.9,35.56 IC3.17 | 20.95,13.97 D7.7 | 84.45,13.97 D5.7
SPI-MISO
  Bottom 0.508: IC1.18 19.05,34.29 17.78,33.02 14.61,33.02 13.34,31.75 9.53,31.75 8.89,31.11 J2.1
SPI-MOSI
  Bottom 0.508: IC3.1 31.11,30.48 29.84,31.75 IC1.17 22.23,31.75 18.41,27.94 13.97,27.94 13.34,27.3 J2.4
SPI-SCLK  (via drill 0.6)
  Top 0.508: IC3.13 59.05,35.56 57.78,34.29 27.3,34.29 24.77,36.83 IC1.19 21.59,36.83 17.78,33.02 v12.7,33.02 | J2.3 7.62,27.3 6.99,27.94 6.99,31.11 v8.89,33.02
  Bottom 0.508: v12.7,33.02 v8.89,33.02
UART-RX
  Top 0.508: IC2.1 51.44,58.42 52.7,57.15 52.7,54.61 51.44,53.34 | IC1.2 17.78,57.15 19.05,55.88 27.3,55.88 R4.2 27.3,55.24 27.3,54.61 29.84,52.07 36.2,52.07 37.47,53.34 OK1.6 | IC2.3 51.44,53.34 | 51.44,53.34 52.7,52.07 52.7,49.53 51.44,48.26 IC2.5
  Bottom 0.508: OK1.6 IC2.3

### Text on the board
tPlace: IN | THRU | THRU | THRU | K | PWR | LX-DESIGNS.COM | MTCDisplay Ver. 1.1 | ICSP | HOURS | MINUTES | SECONDS | FRAMES